# EAGLE design 20200123_second_Platine_Power (EAGLE 7.6.0)
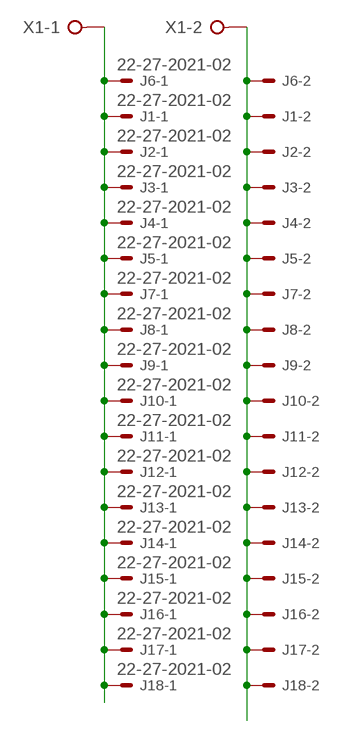
[diagram p0: schematic, sheet 1]

## Parts
J1  22-27-2021-02  [6410-02]
J2  22-27-2021-02  [6410-02]
J3  22-27-2021-02  [6410-02]
J4  22-27-2021-02  [6410-02]
J5  22-27-2021-02  [6410-02]
J6  22-27-2021-02  [6410-02]
J7  22-27-2021-02  [6410-02]
J8  22-27-2021-02  [6410-02]
J9  22-27-2021-02  [6410-02]
J10  22-27-2021-02  [6410-02]
J11  22-27-2021-02  [6410-02]
J12  22-27-2021-02  [6410-02]
J13  22-27-2021-02  [6410-02]
J14  22-27-2021-02  [6410-02]
J15  22-27-2021-02  [6410-02]
J16  22-27-2021-02  [6410-02]
J17  22-27-2021-02  [6410-02]
J18  22-27-2021-02  [6410-02]
X1  W237-02P  [W237-132]

## Nets
+5V: J1.1 J2.1 J3.1 J4.1 J5.1 J6.1 J7.1 J8.1 J9.1 J10.1 J11.1 J12.1 J13.1 J14.1 J15.1 J16.1 J17.1 J18.1 X1.1
GND: J1.2 J2.2 J3.2 J4.2 J5.2 J6.2 J7.2 J8.2 J9.2 J10.2 J11.2 J12.2 J13.2 J14.2 J15.2 J16.2 J17.2 J18.2 X1.2

## Library data of the parts
J1-J18 = con-molex:22-?-02: CONNECTOR wire to board 2.54 mm (.1 inch) pitch header; OC_FARNELL: unknown; OC_NEWARK: unknown
X1 = con-wago-508:W237-02P: WAGO SREW CLAMP; OC_FARNELL: unknown; OC_NEWARK: unknown

## Board
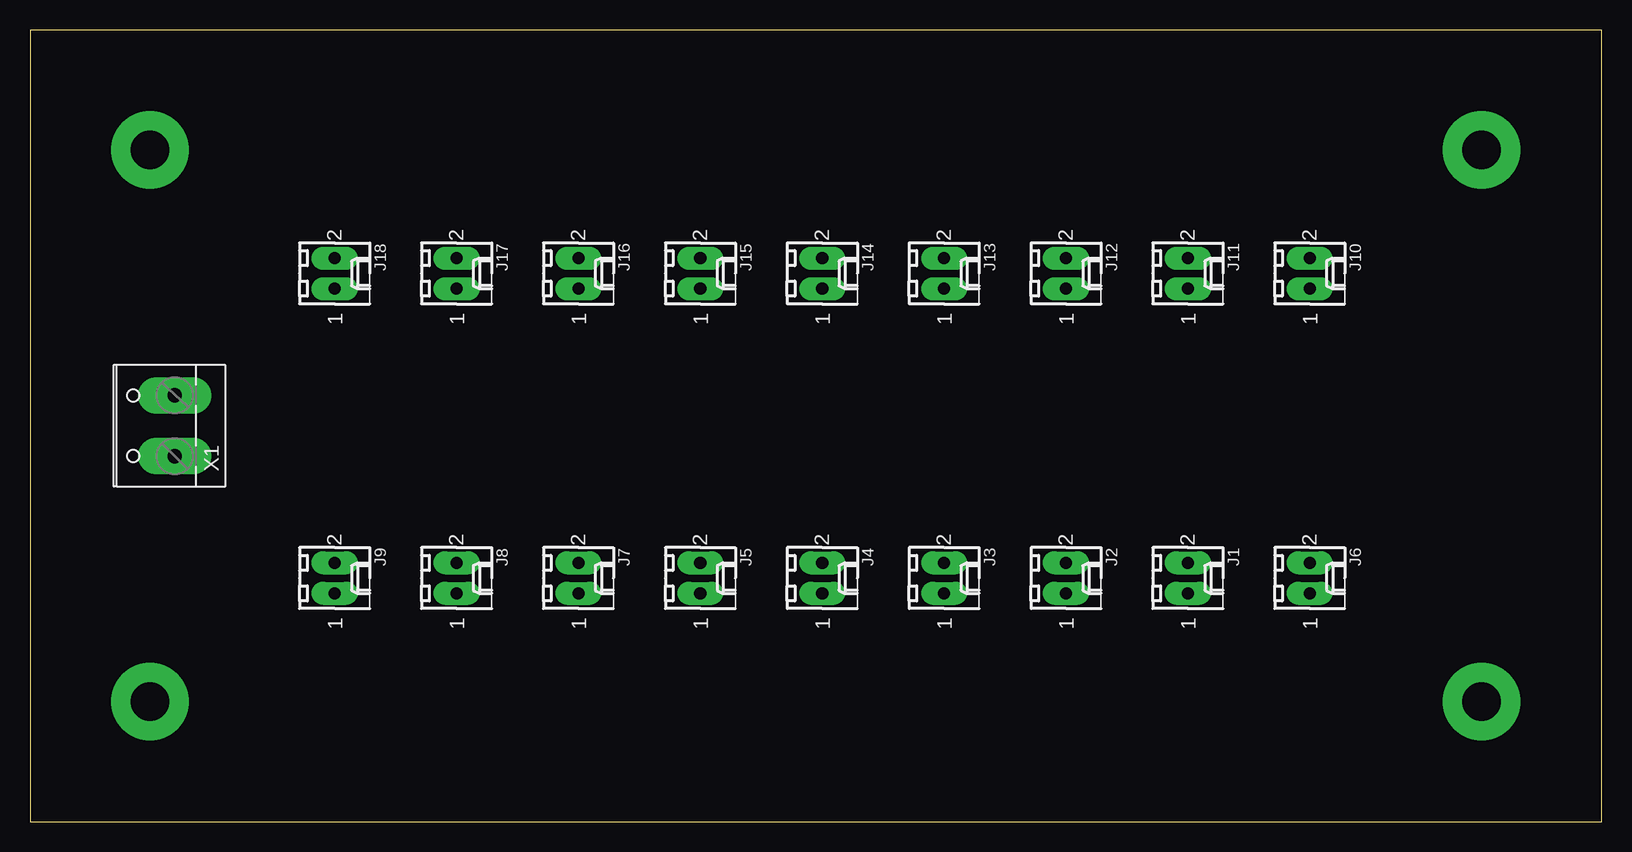
[diagram p1: board, top side]
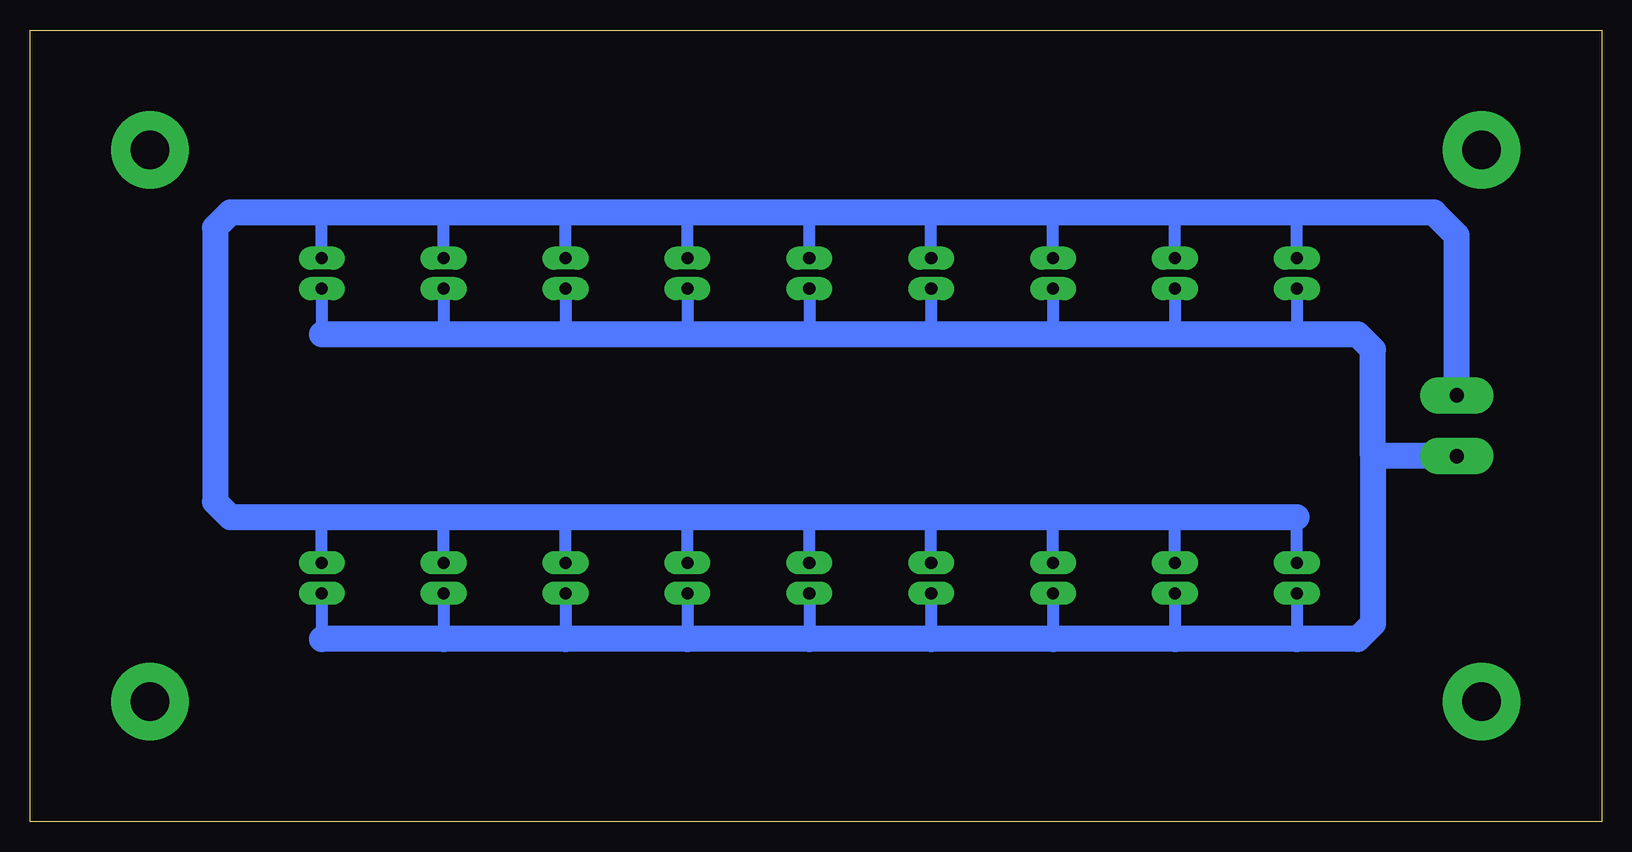
[diagram p2: board, bottom side, seen from below]

Size 131 x 66 mm. Coordinates in mm from the lower left corner, seen from the top.
Outline: 0,0 131,0 131,66 0,66 0,0
Copper layers (1*16): Top 0.035mm / dielectric 1.5mm / Bottom 0.035mm
Design rules "default": minimum track width 6mil, minimum drill 0.35mm, track to track 6mil, track to pad 6mil, pad to pad 6mil, via to via 6mil, smd to smd 6mil, copper to edge 40mil, drill to drill 6mil, minimum pad ring 10mil, minimum via ring 8mil, stop-mask expansion 4mil, vias tented up to drill 0mil, thermal gap 10mil

### Footprints (pad centres in the part's own frame; a part is rotated, then mirrored left to right if it is on the bottom)
6410-02 = drill 1.016 pad 1.93 long: 1 1.27,0; 2 -1.27,0
W237-132 = drill 1.194 pad 3.048 long: 1 -2.54,-0.635; 2 2.54,-0.635

### Placement (x,y rotation side)
J1  96.52,20.3 270 top
J2  86.36,20.3 270 top
J3  76.2,20.3 270 top
J4  66.04,20.3 270 top
J5  55.88,20.3 270 top
J6  106.68,20.3 270 top
J7  45.72,20.3 270 top
J8  35.56,20.3 270 top
J9  25.4,20.3 270 top
J10  106.68,45.7 270 top
J11  96.52,45.7 270 top
J12  86.36,45.7 270 top
J13  76.2,45.7 270 top
J14  66.04,45.7 270 top
J15  55.88,45.7 270 top
J16  45.72,45.7 270 top
J17  35.56,45.7 270 top
J18  25.4,45.7 270 top
X1  11.43,33 90 top

### Tracks (layer width: path | path; a pad name or v marks a point on that pad's centre or on a via)
+5V
  Bottom 1.016: J18.1 25.4,40.62 | J17.1 35.56,40.62 | J16.1 45.72,40.62 | J15.1 55.88,40.62 | J14.1 66.04,40.62 | J13.1 76.2,40.62 | J10.1 106.68,40.62 | J11.1 96.52,40.62 | J12.1 86.36,40.62 | J6.1 106.68,15.22 | J1.1 96.52,15.22 | J2.1 86.36,15.22 | J3.1 76.2,15.22 | J4.1 66.04,15.22 | J5.1 55.88,15.22 | J7.1 45.72,15.22 | J8.1 35.56,15.22 | J9.1 25.4,15.22
  Bottom 2.184: X1.1 19.05,30.46 | 19.05,30.46 19.05,39.35 20.32,40.62 25.4,40.62 35.56,40.62 45.72,40.62 55.88,40.62 66.04,40.62 76.2,40.62 86.36,40.62 96.52,40.62 106.68,40.62 | 19.05,30.46 19.05,16.49 20.32,15.22 25.4,15.22 35.56,15.22 45.72,15.22 55.88,15.22 66.04,15.22 76.2,15.22 86.36,15.22 96.52,15.22 106.68,15.22
GND
  Bottom 1.016: J13.2 76.2,50.78 | J14.2 66.04,50.78 | J15.2 55.88,50.78 | J16.2 45.72,50.78 | J17.2 35.56,50.78 | J18.2 25.4,50.78 | J12.2 86.36,50.78 | J11.2 96.52,50.78 | J10.2 106.68,50.78 | J9.2 25.4,25.38 | J8.2 35.56,25.38 | J7.2 45.72,25.38 | J5.2 55.88,25.38 | J4.2 66.04,25.38 | J3.2 76.2,25.38 | J2.2 86.36,25.38 | J1.2 96.52,25.38 | J6.2 106.68,25.38
  Bottom 2.184: X1.2 12.06,48.88 13.97,50.78 25.4,50.78 35.56,50.78 45.72,50.78 55.88,50.78 66.04,50.78 76.2,50.78 86.36,50.78 96.52,50.78 106.68,50.78 114.3,50.78 115.57,49.51 115.57,26.65 114.3,25.38 106.68,25.38 96.52,25.38 86.36,25.38 76.2,25.38 66.04,25.38 55.88,25.38 45.72,25.38 35.56,25.38 25.4,25.38
N$1  (via drill 3.2 pad 6.45)
  other vias: 10,56
N$2  (via drill 3.2 pad 6.45)
  other vias: 121,56
N$3  (via drill 3.2 pad 6.45)
  other vias: 121,10
N$4  (via drill 3.2 pad 6.45)
  other vias: 10,10